# Altium schematic sheet Display.SchDoc
size A3
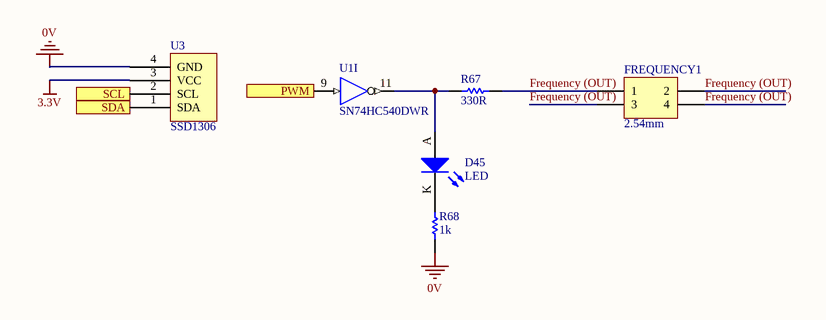
[diagram p0: Display.SchDoc]

## Parts
D45  LED  [0805 LED]
FREQUENCY1  2.54mm  [Header 2x2]
R67  330R  [0805]
R68  1k  [0805]
U1  SN74HC540DWR  [TI 20-SOIC]  (part I of 9)
U3  SSD1306  [IIC 128x32 OLED]

## Ports
PWM, SCL, SDA

## Nets
0V: R68.1 U3.4(GND)
3.3V: U3.3(VCC)
Frequency (OUT): FREQUENCY1.1 FREQUENCY1.2 FREQUENCY1.3 FREQUENCY1.4 R67.2
PWM: U1.9(A8) ; port PWM
SCL: U3.2(SCL) ; port SCL
SDA: U3.1(SDA) ; port SDA
NetD45_A: D45.A R67.1 U1.11(Y8)
NetD45_K: D45.K R68.2

## Library data of the parts
D45 = SML-210LTT86: Red LED Indication - Discrete 1.75V 0805 (2012 Metric); Manufacturer: ROHM Semiconductor; Part Number: SML-210LTT86; Colour: Red; Digikey Part Number: 511-1286-1-ND; Digikey Link: https://www.digikey.com/product-detail/en/rohm-semiconductor/SML-210LTT86/511-1286-1-ND/637099
FREQUENCY1 = Header 2x2: Positions: 4; Angle: 0; Flange: No; Contact: NA; Part Number: Header 2x2; Pitch: 2.54mm; Row Spacing: 2.54mm
R67 = RC0805FR07330RL: Manufacturer: YAGEO; Tolerance: 0.01; Rated Voltage: 0.125W; Part Number: RC0805FR07330RL; Value: 330R; Material: FR-07; qty: 50
R68 = RC0805FR071KL: Manufacturer: YAGEO; Tolerance: 0.01; Rated Voltage: 0.125W; Part Number: RC0805FR071KL; Value: 1k; Material: FR-07; qty: 50
U1 = SN74HC540DWR: IC BUFFER INVERT 6V 20SOIC; Manufacturer: Texas Instruments; Part Number: SN74HC540DWR; Digikey Part Number: 296-8333-1-ND; Digikey Link: https://www.digikey.com/product-detail/en/texas-instruments/SN74HC540DWR/296-8333-1-ND/376710
U3 = SSD1306: AU 0.91" IIC I2C OLED LCD Display Module 128x32 for Arduino PIC SSD1306 3.3V~5V; Part Number: SSD1306; Manufacturer: IIC; Digikey Link: https://www.ebay.com.au/itm/AU-0-91-IIC-I2C-OLED-LCD-Display-Module-128x32-for-Arduino-PIC-SSD1306-3-3V-5V/173740276759?_trkparms=ispr%3D1&hash=item2873ba3c17:m:mtuBFdundu-sO8SF14N9s0Q&enc=AQAEAAACMBPxNw%2BVj6nta7CKEs3N0qXGdDgw5AbtZBK2GBjvTzu8XHiBcI5uLQY2T5XcetHUGO8PuZRarzai%2FQnEDe6BkxUq23f79SyeGX5oa6nluXFEGG0Hz2gFX11EJ6GYaVvL7i6kc6va81t%2FwKg3W0ssZIxhwwMp0Eh%2BfoN3%2FrnYSkd7s7YclAfVoAj%2BaE2AwEV5QVm85FaIjCJvvMHeJfphryi2paEsyevtRWBIghk8SFidXOvhtC5GCTPSeR9JXfeRjZVxl7mexAnG4x8z49OuYCtQWuXZ9QNvOo3RMcMk%2F5bSItT0RwsIG0jBwvLODPvisKQIMwRXM3MwGj9yzOyOZYIdpSvnofANN%2Fg9hrlJjeHKizw4Ga6LAey%2BlexpCRBABzUaVccJco2%2FpVNKV1UVGCKL5zr4%2BwfYHs3IhPQhs65tz9jQnmL6CNZlKVyXJoCkgaVFgwBlkVflMYXL%2BQ6ywD4h3STo%2FCt3NyZDCdseYf54DzEjZBuIFx9YEq5QtoLI1kcGm1pkCFMvpRESH1WvSd%2FgKEiZ8Xf%2FKWTNYoiWh5m%2B%2BiQiSwxthHjU08rIAcRCZgCaKv35l0XRTQIvsqBsEvCN18uoS38NBw5YpFlkSUvSRdNi1QRiSdeRE0SvVLNR2j1ewKdsSHUlME7ra59o1zZ5%2FQh633FqSubhH0lMpD%2FWH%2B%2F9jRhKc0S%2BULy7rnlhuKVSUd%2BeIjdIOrTIRkWcIYPrX11YwluhIJrHwWBB4uET&checksum=17374027675912d05a9cae6e455683321d2000ae08a5&enc=AQAEAAACMBPxNw%2BVj6nta7CKEs3N0qXGdDgw5AbtZBK2GBjvTzu8XHiBcI5uLQY2T5XcetHUGO8PuZRarzai%2FQnEDe6BkxUq23f79SyeGX5oa6nluXFEGG0Hz2gFX11EJ6GYaVvL7i6kc6va81t%2FwKg3W0ssZIxhwwMp0Eh%2BfoN3%2FrnYSkd7s7YclAfVoAj%2BaE2AwEV5QVm85FaIjCJvvMHeJfphryi2paEsyevtRWBIghk8SFidXOvhtC5GCTPSeR9JXfeRjZVxl7mexAnG4x8z49OuYCtQWuXZ9QNvOo3RMcMk%2F5bSItT0RwsIG0jBwvLODPvisKQIMwRXM3MwGj9yzOyOZYIdpSvnofANN%2Fg9hrlJjeHKizw4Ga6LAey%2BlexpCRBABzUaVccJco2%2FpVNKV1UVGCKL5zr4%2BwfYHs3IhPQhs65tz9jQnmL6CNZlKVyXJoCkgaVFgwBlkVflMYXL%2BQ6ywD4h3STo%2FCt3NyZDCdseYf54DzEjZBuIFx9YEq5QtoLI1kcGm1pkCFMvpRESH1WvSd%2FgKEiZ8Xf%2FKWTNYoiWh5m%2B%2BiQiSwxthHjU08rIAcRCZgCaKv35l0XRTQIvsqBsEvCN18uoS38NBw5YpFlkSUvSRdNi1QRiSdeRE0SvVLNR2j1ewKdsSHUlME7ra59o1zZ5%2FQh633FqSubhH0lMpD%2FWH%2B%2F9jRhKc0S%2BULy7rnlhuKVSUd%2BeIjdIOrTIRkWcIYPrX11YwluhIJrHwWBB4uET&checksum=17374027675912d05a9cae6e455683321d2000ae08a5&frcectupt=true